# EAGLE design Circuit Diagram (EAGLE 9.3.0)
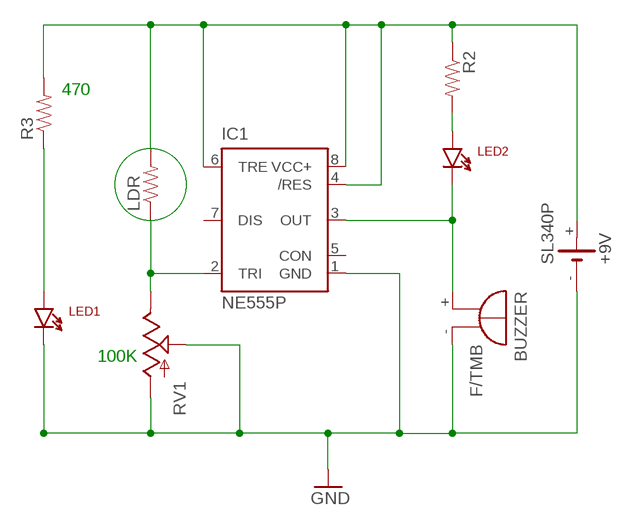
[diagram p0: schematic, sheet 1]

## Parts
+9V  SL340P  [SL-340/P3.6V]
BUZZER  F/TMB  [F/TMB]
IC1  NE555P  [DIL-08]
LDR  RESISTORAXIAL-0.3  [AXIAL-0.3]
LED1  LTE-302  [LTE-302]
LED2  LTE-302  [LTE-302]
R2  RESISTORAXIAL-0.3  [AXIAL-0.3]
R3  RESISTORAXIAL-0.3  [AXIAL-0.3]
RV1  POTTRIM  [TRIM_POT]

## Nets
GND: +9V.- BUZZER.- IC1.1(GND) LED1.C RV1.1(S) RV1.3(A)
N$1: IC1.2(TRI) LDR.P$1 RV1.2(E)
N$2: BUZZER.+ IC1.3(OUT) LED2.C
N$3: LED2.A R2.P$2
N$4: LED1.A R3.P$1
N$5: +9V.+ IC1.4(/RES) IC1.6(TRE) IC1.8(VCC+) LDR.P$2 R2.P$1 R3.P$2
Unconnected: IC1.5(CON) IC1.7(DIS)

## Notes on the sheet
- 470
- 100K

## Library data of the parts
+9V = battery:SL340P: LI BATTERY Sonnenschein SL-340 P 3.6 V
BUZZER = buzzer:F/TMB: BUZZER Source: Buerklin; OC_FARNELL: unknown; OC_NEWARK: unknown
IC1 = SparkFun-AnalogIC:NE555: General purpose bipolar Timer; MF: Arrow Electronics; MPN: NE555N; OC_FARNELL: 1467742; OC_NEWARK: 89K1486
LDR R2 R3 = SparkFun-Passives:RESISTOR: Resistor Basic schematic elements and footprints for 0603, 1206, and PTH resistors.
LED1 LED2 = SparkFun-LED:LTE-302: Through-hole side-firing 940nm IR LED
RV1 = SparkFun-Retired:POT; PROD_ID: COM-00104

## Board
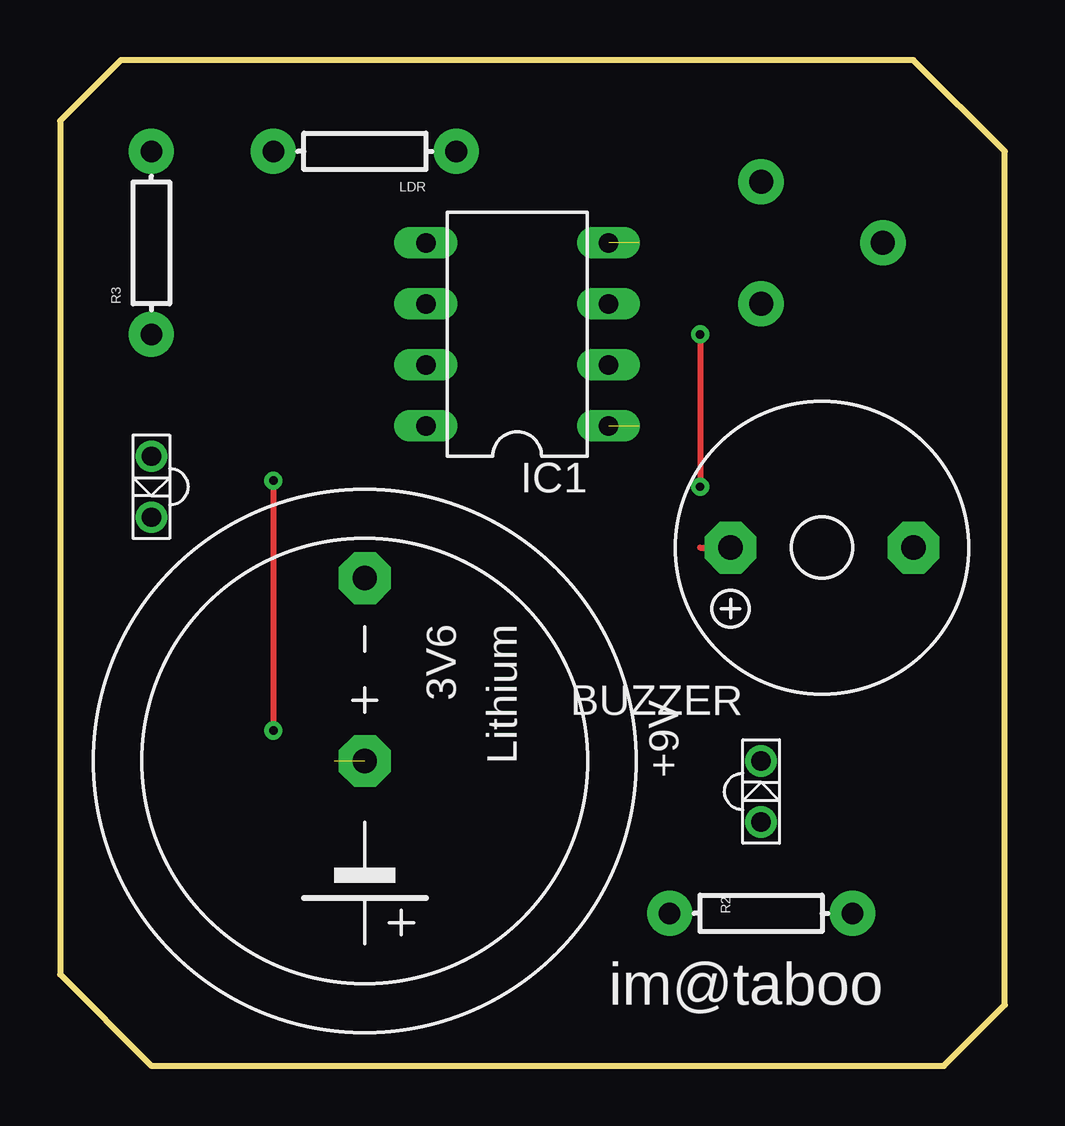
[diagram p1: board, top side]
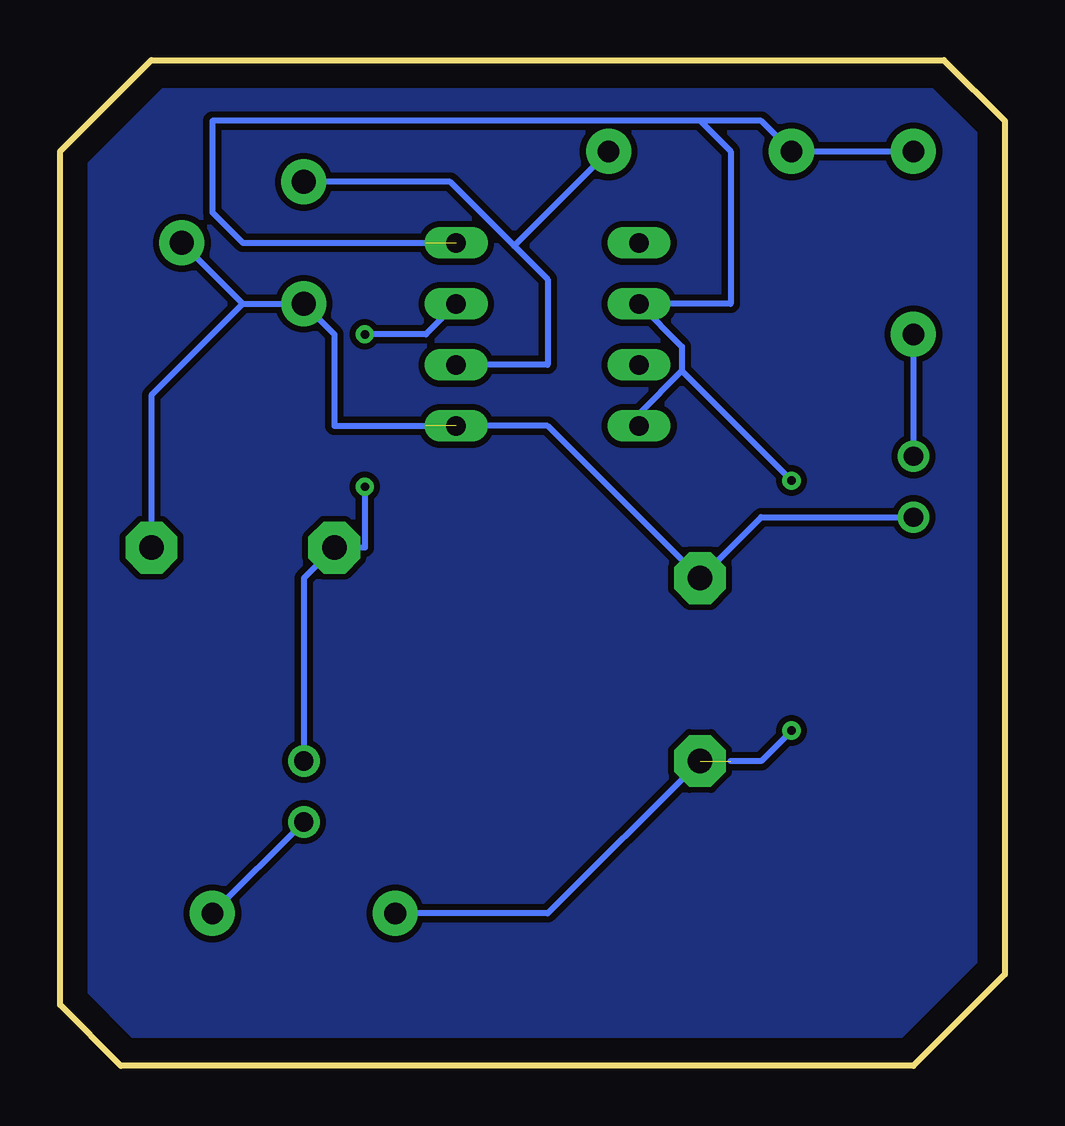
[diagram p2: board, bottom side, seen from below]

Size 39.37 x 41.91 mm. Coordinates in mm from the lower left corner, seen from the top.
Outline: 0,39.37 0,3.81 3.81,0 36.83,0 39.37,2.54 39.37,38.1 35.56,41.91 2.54,41.91 0,39.37
Copper layers (1*16): Top 0.035mm / dielectric 1.5mm / Bottom 0.035mm
Design rules "default *": minimum track width 10mil, minimum drill 0.35mm, track to track 10mil, track to pad 6mil, pad to pad 6mil, via to via 6mil, smd to smd 6mil, copper to edge 40mil, drill to drill 6mil, minimum pad ring 10mil, minimum via ring 8mil, stop-mask expansion 4mil, vias tented up to drill 0mil, thermal gap 10mil

### Footprints (pad centres in the part's own frame; a part is rotated, then mirrored left to right if it is on the bottom)
SL-340/P3.6V = drill 1.016 pad 2.159 octagon: + 0,0; - -7.62,0
F/TMB = drill 1.016 pad 2.159 octagon: + 3.81,0; - -3.81,0
DIL-08 = drill 0.813 long: 1 -3.81,-3.81; 2 -1.27,-3.81; 3 1.27,-3.81; 4 3.81,-3.81; 5 3.81,3.81; 6 1.27,3.81; 7 -1.27,3.81; 8 -3.81,3.81
AXIAL-0.3 = drill 0.9 pad 1.88: P$1 -3.81,0; P$2 3.81,0
LTE-302 = drill 0.8: A 1.27,0; C -1.27,0
TRIM_POT = drill 1 pad 1.88: 1 5.08,0; 2 0,2.54; 3 0,-2.54

### Placement (x,y rotation side)
+9V  12.7,12.7 270 top
BUZZER  31.75,21.59 180 top
IC1  19.05,30.48 90 top
LDR  12.7,38.1 180 top
LED1  3.81,24.13 90 top
LED2  29.21,11.43 270 top
R2  29.21,6.35 0 top
R3  3.81,34.29 90 top
RV1  29.21,34.29 0 top

### Tracks (layer width: path | path; a pad name or v marks a point on that pad's centre or on a via)
GND  (1 unrouted)
  Bottom 0.254: 31.75,31.75 RV1.3 27.94,30.48 27.94,26.67 24.13,26.67 | RV1.1 31.75,31.75 | BUZZER.- 35.56,27.94 31.75,31.75 | LED1.C 10.16,22.86 +9V.- 19.05,26.67 IC1.1
N$1
  Bottom 0.254: 22.1,29.72 22.35,29.72 IC1.2 19.05,29.21 19.05,32.77 20.45,34.16 | RV1.2 23.11,36.83 20.45,34.16 | LDR.P$1 20.45,34.16
N$2  (via drill 0.35)
  Top 0.254: 26.67,21.59 BUZZER.+ | v26.67,30.48 v26.67,24.13
  Bottom 0.254: LED2.C 29.21,20.32 BUZZER.+ 26.67,21.59 v26.67,24.13 | IC1.3 24.13,30.48 v26.67,30.48
N$3
  Bottom 0.254: R2.P$2 LED2.A
N$4
  Bottom 0.254: R3.P$1 LED1.A
N$5  (via drill 0.35)  (2 unrouted)
  Top 0.254: v8.89,24.38 v8.89,13.97
  Bottom 0.254: R2.P$1 19.05,6.35 +9V.+ | IC1.8 15.24,27.18 13.46,28.96 | 13.46,28.96 13.46,29.97 IC1.6 | 12.7,39.37 10.16,39.37 LDR.P$2 R3.P$2 | 12.7,39.37 33.02,39.37 33.02,35.56 31.75,34.29 24.13,34.29 | 15.24,32.26 IC1.6 | 13.46,28.96 v8.89,24.38 | 12.7,39.37 11.43,38.1 11.43,31.75 IC1.6 | v8.89,13.97 10.16,12.7 11.43,12.7
N$7
  pour Bottom: 2.54,41.91 0,39.37 0,3.81 3.81,0 36.83,0 39.37,2.54 39.37,3.81 39.37,38.1 35.56,41.91

### Text on the board
tPlace: im@taboo